# Altium schematic sheet Power.SchDoc
size A3; SheetNumber: 4; SheetTotal: 15
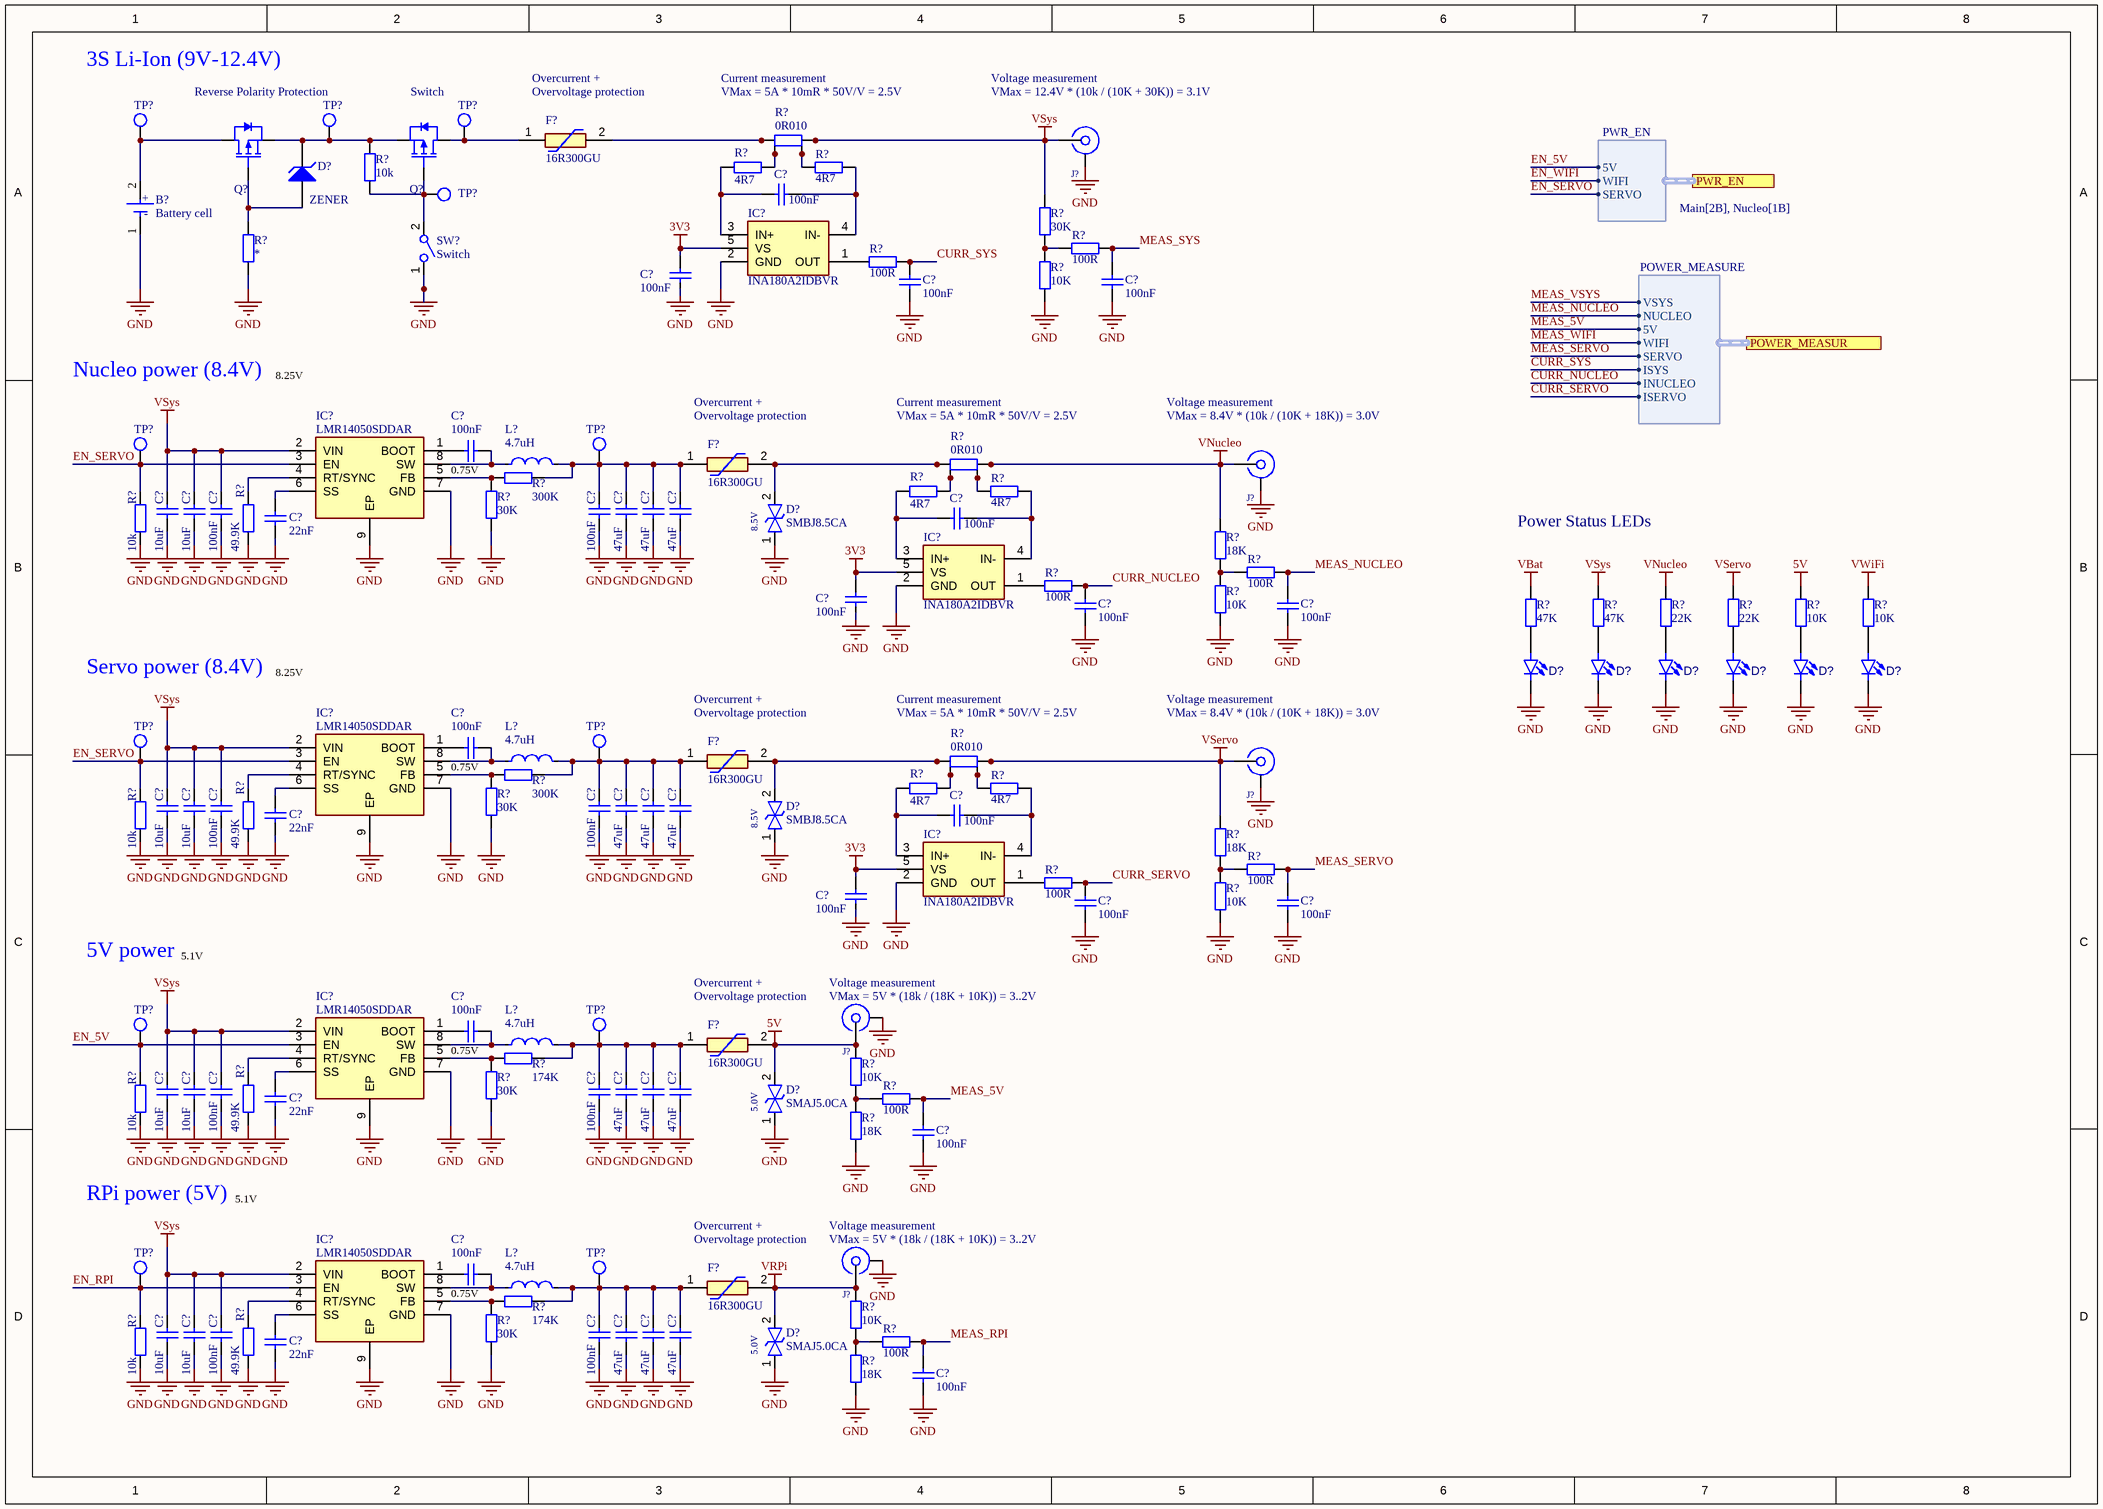
[diagram p0: Power.SchDoc]

## Parts
(Parts that share a designator on the sheet are numbered #1, #2 ... from top to bottom, then left to right.)
B?  Battery cell  [Single battery cell holder]
C?#1  100nF  [CAP0603]
C?#2  100nF  [CAP0603]
C?#3  100nF  [CAP0603]
C?#4  100nF  [CAP0603]
C?#5  100nF  [CAP0603]
C?#6  47uF  [CAP0603]
C?#7  47uF  [CAP0603]
C?#8  47uF  [CAP0603]
C?#9  100nF  [CAP0603]
C?#10  10uF  [CAP0603]
C?#11  10uF  [CAP0603]
C?#12  100nF  [CAP0603]
C?#13  100nF  [CAP0603]
C?#14  22nF  [CAP0603]
C?#15  100nF  [CAP0603]
C?#16  100nF  [CAP0603]
C?#17  100nF  [CAP0603]
C?#18  100nF  [CAP0603]
C?#19  47uF  [CAP0603]
C?#20  47uF  [CAP0603]
C?#21  47uF  [CAP0603]
C?#22  100nF  [CAP0603]
C?#23  10uF  [CAP0603]
C?#24  10uF  [CAP0603]
C?#25  100nF  [CAP0603]
C?#26  100nF  [CAP0603]
C?#27  22nF  [CAP0603]
C?#28  100nF  [CAP0603]
C?#29  100nF  [CAP0603]
C?#30  100nF  [CAP0603]
C?#31  100nF  [CAP0603]
C?#32  47uF  [CAP0603]
C?#33  47uF  [CAP0603]
C?#34  47uF  [CAP0603]
C?#35  10uF  [CAP0603]
C?#36  10uF  [CAP0603]
C?#37  100nF  [CAP0603]
C?#38  100nF  [CAP0603]
C?#39  22nF  [CAP0603]
C?#40  100nF  [CAP0603]
C?#41  100nF  [CAP0603]
C?#42  47uF  [CAP0603]
C?#43  47uF  [CAP0603]
C?#44  47uF  [CAP0603]
C?#45  10uF  [CAP0603]
C?#46  10uF  [CAP0603]
C?#47  100nF  [CAP0603]
C?#48  100nF  [CAP0603]
C?#49  22nF  [CAP0603]
C?#50  100nF  [CAP0603]
D?#1  ZENER  [FP_SMA]
D?#2  SMBJ8.5CA  [SMB_BI]
D?#3  (no value)  [LED0603]
D?#4  (no value)  [LED0603]
D?#5  (no value)  [LED0603]
D?#6  (no value)  [LED0603]
D?#7  (no value)  [LED0603]
D?#8  (no value)  [LED0603]
D?#9  SMBJ8.5CA  [SMB_BI]
D?#10  SMAJ5.0CA  [SMA_BI]
D?#11  SMAJ5.0CA  [SMA_BI]
F?#1  16R300GU  [Polyfuse]
F?#2  16R300GU  [Polyfuse]
F?#3  16R300GU  [Polyfuse]
F?#4  16R300GU  [Polyfuse]
F?#5  16R300GU  [Polyfuse]
IC?#1  INA180A2IDBVR  [SOT23-5]
IC?#2  LMR14050SDDAR  [SOIC-8-TP]
IC?#3  INA180A2IDBVR  [SOT23-5]
IC?#4  LMR14050SDDAR  [SOIC-8-TP]
IC?#5  INA180A2IDBVR  [SOT23-5]
IC?#6  LMR14050SDDAR  [SOIC-8-TP]
IC?#7  LMR14050SDDAR  [SOIC-8-TP]
J?#1  UFL  [UFL]  (value not drawn)
J?#2  UFL  [UFL]  (value not drawn)
J?#3  UFL  [UFL]  (value not drawn)
J?#4  UFL  [UFL]  (value not drawn)
J?#5  UFL  [UFL]  (value not drawn)
L?#1  4.7uH
L?#2  4.7uH
L?#3  4.7uH
L?#4  4.7uH
Q?#1  P-MOSFET  (value not drawn)
Q?#2  P-MOSFET  (value not drawn)
R?#1  10k  [RES0603]
R?#2  0R010  [RES1206_KELVIN]
R?#3  4R7  [RES0603]
R?#4  4R7  [RES0603]
R?#5  30K  [RES0603]
R?#6  100R  [RES0603]
R?#7  100R  [RES0603]
R?#8  *  [RES0603]
R?#9  10K  [RES0603]
R?#10  0R010  [RES1206_KELVIN]
R?#11  300K  [RES0603]
R?#12  4R7  [RES0603]
R?#13  4R7  [RES0603]
R?#14  18K  [RES0603]
R?#15  30K  [RES0603]
R?#16  10k  [RES0603]
R?#17  49.9K  [RES0603]
R?#18  100R  [RES0603]
R?#19  100R  [RES0603]
R?#20  10K  [RES0603]
R?#21  47K  [RES0603]
R?#22  47K  [RES0603]
R?#23  22K  [RES0603]
R?#24  22K  [RES0603]
R?#25  10K  [RES0603]
R?#26  10K  [RES0603]
R?#27  0R010  [RES1206_KELVIN]
R?#28  300K  [RES0603]
R?#29  4R7  [RES0603]
R?#30  4R7  [RES0603]
R?#31  18K  [RES0603]
R?#32  30K  [RES0603]
R?#33  10k  [RES0603]
R?#34  49.9K  [RES0603]
R?#35  100R  [RES0603]
R?#36  100R  [RES0603]
R?#37  10K  [RES0603]
R?#38  174K  [RES0603]
R?#39  10K  [RES0603]
R?#40  100R  [RES0603]
R?#41  30K  [RES0603]
R?#42  10k  [RES0603]
R?#43  49.9K  [RES0603]
R?#44  18K  [RES0603]
R?#45  174K  [RES0603]
R?#46  10K  [RES0603]
R?#47  100R  [RES0603]
R?#48  30K  [RES0603]
R?#49  10k  [RES0603]
R?#50  49.9K  [RES0603]
R?#51  18K  [RES0603]
SW?  Switch
TP?#1  Test Point  [TP_1.5HOLE]  (value not drawn)
TP?#2  Test Point  [TP_1.5HOLE]  (value not drawn)
TP?#3  Test Point  [TP_1.5HOLE]  (value not drawn)
TP?#4  Test Point  [TP_1.5HOLE]  (value not drawn)
TP?#5  Test Point  [TP_1.5HOLE]  (value not drawn)
TP?#6  Test Point  [TP_1.5HOLE]  (value not drawn)
TP?#7  Test Point  [TP_1.5HOLE]  (value not drawn)
TP?#8  Test Point  [TP_1.5HOLE]  (value not drawn)
TP?#9  Test Point  [TP_1.5HOLE]  (value not drawn)
TP?#10  Test Point  [TP_1.5HOLE]  (value not drawn)
TP?#11  Test Point  [TP_1.5HOLE]  (value not drawn)
TP?#12  Test Point  [TP_1.5HOLE]  (value not drawn)

## Ports
POWER_MEASUR (harness POWER_MEASURE), PWR_EN (harness PWR_EN, see Main[2B], Nucleo[1B])

## Harnesses
POWER_MEASURE: VSYS, NUCLEO, 5V, WIFI, SERVO, ISYS, INUCLEO, ISERVO
PWR_EN: 5V, WIFI, SERVO

## Nets
3V3: C?#2.2 C?#15.2 C?#28.2 IC?#1.5(VS) IC?#3.5(VS) IC?#5.5(VS)
5V: D?#10.2 F?#4.2 J?#4.1 R?#25.2 R?#39.2
GND: B?.1(C) C?#2.1 C?#3.1 C?#4.1 C?#6.2 C?#7.2 C?#8.2 C?#10.1 C?#11.1 C?#12.1 C?#13.1 C?#14.1 C?#15.1 C?#16.1 C?#17.1 C?#19.2 C?#20.2 C?#21.2 C?#23.1 C?#24.1 C?#25.1 C?#26.1 C?#27.1 C?#28.1 C?#29.1 C?#30.1 C?#32.2 C?#33.2 C?#34.2 C?#35.1 C?#36.1 C?#37.1 C?#38.1 C?#39.1 C?#40.1 C?#42.2 C?#43.2 C?#44.2 C?#45.1 C?#46.1 C?#47.1 C?#48.1 C?#49.1 C?#50.1 D?#2.1 D?#3.1(K) D?#4.1(K) D?#5.1(K) D?#6.1(K) D?#7.1(K) D?#8.1(K) D?#9.1 D?#10.1 D?#11.1 IC?#1.2(GND) IC?#2.7(GND) IC?#2.9(EP) IC?#3.2(GND) IC?#4.7(GND) IC?#4.9(EP) IC?#5.2(GND) IC?#6.7(GND) IC?#6.9(EP) IC?#7.7(GND) IC?#7.9(EP) J?#1.2 J?#2.2 J?#3.2 J?#4.2 J?#5.2 R?#8.1 R?#9.1 R?#15.1 R?#16.1 R?#17.1 R?#20.1 R?#32.1 R?#33.1 R?#34.1 R?#37.1 R?#41.1 R?#42.1 R?#43.1 R?#44.1 R?#48.1 R?#49.1 R?#50.1 R?#51.1 SW?.1
VBat: R?#21.2
VNucleo: J?#2.1 R?#10.2 R?#14.1 R?#23.2
VRPi: D?#11.2 F?#5.2 J?#5.1 R?#46.2
VServo: J?#3.1 R?#24.2 R?#27.2 R?#31.1
VSys: C?#10.2 C?#11.2 C?#12.2 C?#23.2 C?#24.2 C?#25.2 C?#35.2 C?#36.2 C?#37.2 C?#45.2 C?#46.2 C?#47.2 IC?#2.2(VIN) IC?#4.2(VIN) IC?#6.2(VIN) IC?#7.2(VIN) J?#1.1 R?#2.2 R?#5.2 R?#22.2
VWiFi: R?#26.2
CURR_NUCLEO: C?#16.2 R?#19.2 ; port POWER_MEASUR.INUCLEO
CURR_SERVO: C?#29.2 R?#36.2 ; port POWER_MEASUR.ISERVO
CURR_SYS: C?#3.2 R?#7.2 ; port POWER_MEASUR.ISYS
EN_5V: IC?#6.3(EN) R?#42.2 TP?#9.1 ; port PWR_EN.5V
EN_RPI: IC?#7.3(EN) R?#49.2 TP?#11.1
EN_SERVO: IC?#2.3(EN) IC?#4.3(EN) R?#16.2 R?#33.2 TP?#5.1 TP?#7.1 ; port PWR_EN.SERVO
EN_WIFI: port PWR_EN.WIFI
MEAS_5V: C?#40.2 R?#40.2 ; port POWER_MEASUR.5V
MEAS_NUCLEO: C?#17.2 R?#18.2 ; port POWER_MEASUR.NUCLEO
MEAS_RPI: C?#50.2 R?#47.2
MEAS_SERVO: C?#30.2 R?#35.2 ; port POWER_MEASUR.SERVO
MEAS_SYS: C?#4.2 R?#6.2
MEAS_VSYS: port POWER_MEASUR.VSYS
MEAS_WIFI: port POWER_MEASUR.WIFI
NetB?_2: B?.2(A) Q?#1.3(D) TP?#1.1
NetC?#1_1: C?#1.1 IC?#1.4(IN-) R?#4.1
NetC?#1_2: C?#1.2 IC?#1.3(IN+) R?#3.2
NetC?#5_1: C?#5.1 IC?#2.1(BOOT)
NetC?#5_2: C?#5.2 IC?#2.8(SW) L?#1.1
NetC?#6_1: C?#6.1 C?#7.1 C?#8.1 C?#13.2 F?#2.1 L?#1.2 R?#11.1 TP?#6.1
NetC?#9_1: C?#9.1 IC?#3.4(IN-) R?#13.1
NetC?#9_2: C?#9.2 IC?#3.3(IN+) R?#12.2
NetC?#14_2: C?#14.2 IC?#2.6(SS)
NetC?#18_1: C?#18.1 IC?#4.1(BOOT)
NetC?#18_2: C?#18.2 IC?#4.8(SW) L?#2.1
NetC?#19_1: C?#19.1 C?#20.1 C?#21.1 C?#26.2 F?#3.1 L?#2.2 R?#28.1 TP?#8.1
NetC?#22_1: C?#22.1 IC?#5.4(IN-) R?#30.1
NetC?#22_2: C?#22.2 IC?#5.3(IN+) R?#29.2
NetC?#27_2: C?#27.2 IC?#4.6(SS)
NetC?#31_1: C?#31.1 IC?#6.1(BOOT)
NetC?#31_2: C?#31.2 IC?#6.8(SW) L?#3.1
NetC?#32_1: C?#32.1 C?#33.1 C?#34.1 C?#38.2 F?#4.1 L?#3.2 R?#38.1 TP?#10.1
NetC?#39_2: C?#39.2 IC?#6.6(SS)
NetC?#41_1: C?#41.1 IC?#7.1(BOOT)
NetC?#41_2: C?#41.2 IC?#7.8(SW) L?#4.1
NetC?#42_1: C?#42.1 C?#43.1 C?#44.1 C?#48.2 F?#5.1 L?#4.2 R?#45.1 TP?#12.1
NetC?#49_2: C?#49.2 IC?#7.6(SS)
NetD?#1_1: D?#1.1(A) Q?#1.1(G) R?#8.2
NetD?#1_2: D?#1.2(K) Q?#1.2(S) Q?#2.2(S) R?#1.1 TP?#2.1
NetD?#2_2: D?#2.2 F?#2.2 R?#10.1
NetD?#3_2: D?#3.2(A) R?#21.1
NetD?#4_2: D?#4.2(A) R?#22.1
NetD?#5_2: D?#5.2(A) R?#23.1
NetD?#6_2: D?#6.2(A) R?#24.1
NetD?#7_2: D?#7.2(A) R?#25.1
NetD?#8_2: D?#8.2(A) R?#26.1
NetD?#9_2: D?#9.2 F?#3.2 R?#27.1
NetF?#1_1: F?#1.1 Q?#2.3(D) TP?#3.1
NetF?#1_2: F?#1.2 R?#2.1
NetIC?#1_1: IC?#1.1(OUT) R?#7.1
NetIC?#2_4: IC?#2.4(RT/SYNC) R?#17.2
NetIC?#2_5: IC?#2.5(FB) R?#11.2 R?#15.2
NetIC?#3_1: IC?#3.1(OUT) R?#19.1
NetIC?#4_4: IC?#4.4(RT/SYNC) R?#34.2
NetIC?#4_5: IC?#4.5(FB) R?#28.2 R?#32.2
NetIC?#5_1: IC?#5.1(OUT) R?#36.1
NetIC?#6_4: IC?#6.4(RT/SYNC) R?#43.2
NetIC?#6_5: IC?#6.5(FB) R?#38.2 R?#41.2
NetIC?#7_4: IC?#7.4(RT/SYNC) R?#50.2
NetIC?#7_5: IC?#7.5(FB) R?#45.2 R?#48.2
NetQ?#2_1: Q?#2.1(G) R?#1.2 SW?.2 TP?#4.1
NetR?#2_3: R?#2.3 R?#3.1
NetR?#2_4: R?#2.4 R?#4.2
NetR?#5_1: R?#5.1 R?#6.1 R?#9.2
NetR?#10_3: R?#10.3 R?#12.1
NetR?#10_4: R?#10.4 R?#13.2
NetR?#14_2: R?#14.2 R?#18.1 R?#20.2
NetR?#27_3: R?#27.3 R?#29.1
NetR?#27_4: R?#27.4 R?#30.2
NetR?#31_2: R?#31.2 R?#35.1 R?#37.2
NetR?#39_1: R?#39.1 R?#40.1 R?#44.2
NetR?#46_1: R?#46.1 R?#47.1 R?#51.2

## Notes on the sheet
- 3S Li-Ion (9V-12.4V)
- Reverse Polarity Protection
- Switch
- Overcurrent +
- (near F?#1) Overvoltage protection
- Current measurement
- (near R?#2) VMax = 5A * 10mR * 50V/V = 2.5V
- Voltage measurement
- (near J?#1) VMax = 12.4V * (10k / (10K + 30K)) = 3.1V
- Nucleo power (8.4V)
- 8.25V
- (near F?#2) Overvoltage protection
- (near R?#10) VMax = 5A * 10mR * 50V/V = 2.5V
- (near J?#2) VMax = 8.4V * (10k / (10K + 18K)) = 3.0V
- 0.75V
- Power Status LEDs
- Servo power (8.4V)
- (near F?#3) Overvoltage protection
- (near R?#27) VMax = 5A * 10mR * 50V/V = 2.5V
- (near J?#3) VMax = 8.4V * (10k / (10K + 18K)) = 3.0V
- 5V power
- 5.1V
- (near J?#4) Voltage measurement
- Overvoltage protection
- (near J?#4) VMax = 5V * (18k / (18K + 10K)) = 3..2V
- RPi power (5V)
- (near J?#5) VMax = 5V * (18k / (18K + 10K)) = 3..2V
- (near J?#5) Voltage measurement
- Size
- Date
- A3
- Title
- Sheet number
- Author
- Revision
- (in symbol Battery cell) +; -

## Library data of the parts
C?#1-C?#50 = Capacitor: Voltage: *
  C?#1-C?#5 C?#9 C?#12 C?#13 C?#15-C?#18 C?#22 C?#25 C?#26 C?#28-C?#31 C?#37 C?#38 C?#40 C?#41 C?#47 C?#48 C?#50: Value: 100nF
  C?#6-C?#8 C?#19-C?#21 C?#32-C?#34 C?#42-C?#44: Value: 47uF
  C?#10 C?#11 C?#23 C?#24 C?#35 C?#36 C?#45 C?#46: Value: 10uF
  C?#14 C?#27 C?#39 C?#49: Value: 22nF
D?#1 = ZENER: Zener Diode; U_Z: 24
D?#2 D?#9 = SMBJ8.5CA: 41.8A 600W 14.5V 9.44V Bidirectional 8.6V DO-214AA(SMB) TVS Diodes ROHS; Manufacturer_Name: GOODWORK; Vrwm: 8.5V; Breakdown voltage: 10V; Clamping voltage: 14.4V; Manufacturer_Part_Number: SMBJ8.5CA; Mouser Part Number: *; LCSC Part Number: C33127061
D?#3-D?#8 = LED: Light Emitting Diode
D?#10 D?#11 = SMAJ5.0CA: 43.5A 400W 9.2V 6.4V Bidirectional 5V DO-214AC(SMA) TVS Diodes ROHS; Manufacturer_Name: GOODWORK; Vrwm: 5.0V; Manufacturer_Part_Number: SMAJ5.0CA; Mouser Part Number: *; LCSC Part Number: C908809; Breakdown voltage: 6.4V; Clamping voltage: 9.2V
F?#1-F?#5 = 16R300GU: Fuse; Manufacturer_Name: LITTELFUSE; Datasheet Link: https://componentsearchengine.com/Datasheets/2/16R300GU.pdf; Height: 11mm; Manufacturer_Part_Number: 16R300GU; Mouser Part Number: 576-16R300GU; Mouser Price/Stock: https://www.mouser.co.uk/ProductDetail/Littelfuse/16R300GU?qs=ZSIFh4sPSRouCQaFuDECOQ%3D%3D; Arrow Part Number: 16R300GU; Arrow Price/Stock: https://www.arrow.com/en/products/16r300gu/littelfuse?region=europe
IC?#1 IC?#3 IC?#5 = INA180A2IDBVR: Integrated Circuit; Manufacturer_Name: Texas Instruments; Datasheet Link: http://www.ti.com/lit/ds/symlink/ina180.pdf; Height: 1.45mm; Manufacturer_Part_Number: INA180A2IDBVR; Mouser Part Number: 595-INA180A2IDBVR; Mouser Price/Stock: https://www.mouser.co.uk/ProductDetail/Texas-Instruments/INA180A2IDBVR?qs=5aG0NVq1C4wYcJfa99BoHg%3D%3D; Arrow Part Number: INA180A2IDBVR; Arrow Price/Stock: https://www.arrow.com/en/products/ina180a2idbvr/texas-instruments?utm_currency=USD&region=nac; LCSC Part Number: C192764
IC?#2 IC?#4 IC?#6 IC?#7 = LMR14050SDDAR: Integrated Circuit; Manufacturer_Name: Texas Instruments; Datasheet Link: http://www.ti.com/lit/gpn/lmr14050; Height: 1.7mm; Manufacturer_Part_Number: LMR14050SDDAR; Mouser Part Number: 595-LMR14050SDDAR; Mouser Price/Stock: https://www.mouser.co.uk/ProductDetail/Texas-Instruments/LMR14050SDDAR?qs=G5PZsBocSXuzvyUQdQ5q2Q%3D%3D; Arrow Part Number: LMR14050SDDAR; Arrow Price/Stock: https://www.arrow.com/en/products/lmr14050sddar/texas-instruments?utm_currency=USD&region=nac
L?#1-L?#4 = Inductor: Value: 4.7uH
Q?#1 Q?#2 = P-MOSFET: P channel MOSFET
R?#1 R?#3-R?#9 R?#11-R?#26 R?#28-R?#51 = Resistor
  R?#1 R?#16 R?#33 R?#42 R?#49: Value: 10k
  R?#3 R?#4 R?#12 R?#13 R?#29 R?#30: Value: 4R7
  R?#5 R?#15 R?#32 R?#41 R?#48: Value: 30K
  R?#6 R?#7 R?#18 R?#19 R?#35 R?#36 R?#40 R?#47: Value: 100R
  R?#8: Value: *
  R?#9 R?#20 R?#25 R?#26 R?#37 R?#39 R?#46: Value: 10K
  R?#11 R?#28: Value: 300K; LCSC Part Number: C23024
  R?#14 R?#31 R?#44 R?#51: Value: 18K
  R?#17 R?#34 R?#43 R?#50: Value: 49.9K
  R?#21 R?#22: Value: 47K
  R?#23 R?#24: Value: 22K
  R?#38 R?#45: Value: 174K; LCSC Part Number: C22890
R?#2 R?#10 R?#27 = 0R010: Resistor Current Sense Metal Foil 1206 10m Ohm 1% 1W ±50ppm/°C T/R; Manufacturer: Eaton; Manufacturer Part Number: MFSA1206R0050FCM; Supplier Part Number: 504-MFSA1206R0050FCM; RoHS: No; Category: Chip SMD Resistors; Stock: 9199; Pricing: 1=0.21, 10=0.173, 50=0.173, 100=0.128, 1000=0.096, 10000=0.062 (USD); Temperature Coefficient: 50ppm/°C; Value: 0R010